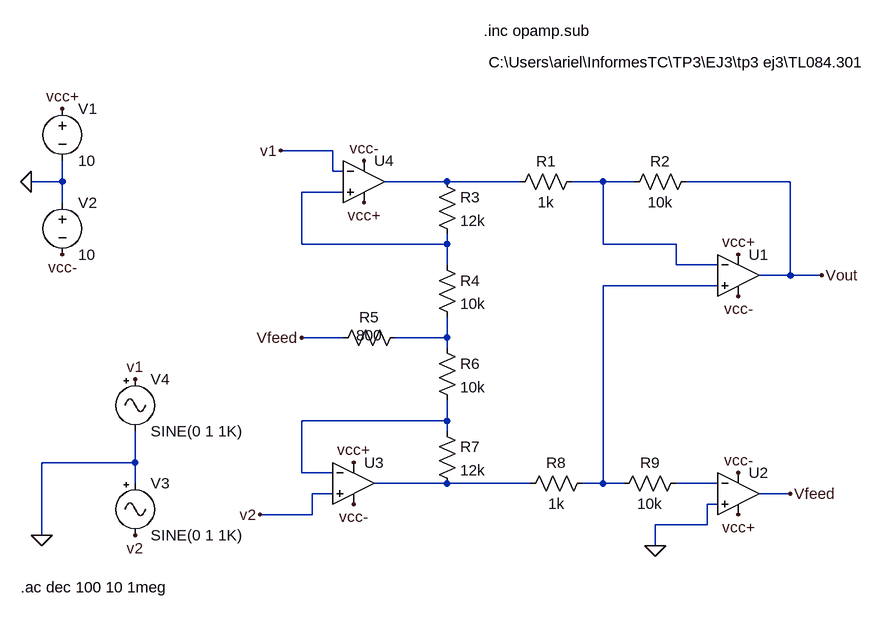
[diagram p0: schematic spice_test_no_ideal_01.asc]
spice_test_no_ideal_01.asc, the LTspice schematic file:
Version 4
SHEET 1 1128 972
WIRE 32 96 -48 96
WIRE 32 128 32 96
WIRE 48 128 32 128
WIRE -384 144 -384 112
WIRE -384 144 -432 144
WIRE 208 144 112 144
WIRE 320 144 208 144
WIRE 448 144 400 144
WIRE 496 144 448 144
WIRE 736 144 576 144
WIRE 48 160 -16 160
WIRE -384 176 -384 144
WIRE -16 240 -16 160
WIRE 208 240 208 224
WIRE 208 240 -16 240
WIRE 448 240 448 144
WIRE 560 240 448 240
WIRE 208 272 208 240
WIRE 560 272 560 240
WIRE 624 272 560 272
WIRE 736 288 736 144
WIRE 736 288 688 288
WIRE 784 288 736 288
WIRE 624 304 448 304
WIRE 48 384 -16 384
WIRE 208 384 208 352
WIRE 208 384 128 384
WIRE 208 400 208 384
WIRE 208 512 208 480
WIRE 208 512 -16 512
WIRE 208 528 208 512
WIRE -272 576 -272 528
WIRE -272 576 -416 576
WIRE -16 592 -16 512
WIRE 32 592 -16 592
WIRE -272 608 -272 576
WIRE 208 608 96 608
WIRE 336 608 208 608
WIRE 448 608 448 304
WIRE 448 608 416 608
WIRE 480 608 448 608
WIRE 624 608 560 608
WIRE 32 624 0 624
WIRE 736 624 688 624
WIRE 624 640 608 640
WIRE 0 656 0 624
WIRE 0 656 -80 656
WIRE 608 672 608 640
WIRE 608 672 528 672
WIRE -416 688 -416 576
WIRE 528 704 528 672
FLAG -16 384 Vfeed
FLAG 736 624 Vfeed
FLAG -416 688 0
FLAG -272 448 v1
FLAG -48 96 v1
FLAG -80 656 v2
FLAG -272 688 v2
FLAG 784 288 Vout
FLAG -432 144 0
FLAG -384 32 vcc+
FLAG -384 256 vcc-
FLAG 656 656 vcc+
FLAG 656 592 vcc-
FLAG 64 576 vcc+
FLAG 80 176 vcc+
FLAG 656 256 vcc+
FLAG 80 112 vcc-
FLAG 656 320 vcc-
FLAG 64 640 vcc-
FLAG 528 704 0
SYMBOL res 192 128 R0
SYMATTR InstName R3
SYMATTR Value 12k
SYMBOL res 192 256 R0
SYMATTR InstName R4
SYMATTR Value 10k
SYMBOL res 192 384 R0
SYMATTR InstName R6
SYMATTR Value 10k
SYMBOL res 192 512 R0
SYMATTR InstName R7
SYMATTR Value 12k
SYMBOL res 416 128 R90
WINDOW 0 0 56 VBottom 2
WINDOW 3 32 56 VTop 2
SYMATTR InstName R1
SYMATTR Value 1k
SYMBOL res 592 128 R90
WINDOW 0 0 56 VBottom 2
WINDOW 3 32 56 VTop 2
SYMATTR InstName R2
SYMATTR Value 10k
SYMBOL res 432 592 R90
WINDOW 0 0 56 VBottom 2
WINDOW 3 32 56 VTop 2
SYMATTR InstName R8
SYMATTR Value 1k
SYMBOL res 576 592 R90
WINDOW 0 0 56 VBottom 2
WINDOW 3 32 56 VTop 2
SYMATTR InstName R9
SYMATTR Value 10k
SYMBOL res 144 368 R90
WINDOW 0 0 56 VBottom 2
WINDOW 3 28 56 VBottom 2
SYMATTR InstName R5
SYMATTR Value 800
SYMBOL voltage -384 16 R0
SYMATTR InstName V1
SYMATTR Value 10
SYMBOL voltage -384 160 R0
SYMATTR InstName V2
SYMATTR Value 10
SYMBOL Misc\\signal -272 592 R0
SYMATTR InstName V3
SYMBOL Misc\\signal -272 432 R0
SYMATTR InstName V4
SYMBOL Opamps\\UniversalOpamp2 656 288 R0
SYMATTR InstName U1
SYMATTR Value2 Avol=200K GBW=3Meg Slew=13Meg
SYMBOL Opamps\\UniversalOpamp2 656 624 R0
SYMATTR InstName U2
SYMATTR Value2 Avol=200k GBW=3Meg Slew=13Meg
SYMBOL Opamps\\UniversalOpamp2 64 608 R0
SYMATTR InstName U3
SYMATTR Value2 Avol=200k GBW=3Meg Slew=13Meg
SYMBOL Opamps\\UniversalOpamp2 80 144 R0
SYMATTR InstName U4
SYMATTR Value2 Avol=200k GBW=3Meg Slew=13Meg
TEXT -448 768 Left 2 !.ac dec 100 10 1meg
TEXT 264 -88 Left 2 !.inc opamp.sub
TEXT 272 -40 Left 2 !C:\\Users\\ariel\\InformesTC\\TP3\\EJ3\\tp3 ej3\\TL084.301

The netlist it stands for:
* spice_test_no_ideal_01.asc
R3 N001 N003 12k
R4 N003 N005 10k
R6 N005 N006 10k
R7 N006 N007 12k
R1 N002 N001 1k
R2 Vout N002 10k
R8 N004 N007 1k
R9 N008 N004 10k
R5 N005 Vfeed 800
V1 vcc+ 0 10
V2 0 vcc- 10
V3 0 v2 SINE(0 1 1K)
V4 v1 0 SINE(0 1 1K)
XU1 N004 N002 vcc+ vcc- Vout level.2 Avol=200K GBW=3Meg Slew=13Meg ilimit=25m rail=0 Vos=0 phimargin=45 en=0 enk=0 in=0 ink=0 Rin=500Meg  ; pins IN+ IN- V+ V- OUT
XU2 0 N008 vcc- vcc+ Vfeed level.2 Avol=200k GBW=3Meg Slew=13Meg ilimit=25m rail=0 Vos=0 phimargin=45 en=0 enk=0 in=0 ink=0 Rin=500Meg  ; pins IN+ IN- V+ V- OUT
XU3 v2 N006 vcc+ vcc- N007 level.2 Avol=200k GBW=3Meg Slew=13Meg ilimit=25m rail=0 Vos=0 phimargin=45 en=0 enk=0 in=0 ink=0 Rin=500Meg  ; pins IN+ IN- V+ V- OUT
XU4 N003 v1 vcc- vcc+ N001 level.2 Avol=200k GBW=3Meg Slew=13Meg ilimit=25m rail=0 Vos=0 phimargin=45 en=0 enk=0 in=0 ink=0 Rin=500Meg  ; pins IN+ IN- V+ V- OUT
.ac dec 100 10 1meg
.inc opamp.sub
C:\Users\ariel\InformesTC\TP3\EJ3\tp3 ej3\TL084.301
.lib UniversalOpamps2.sub
.backanno
.end